# EAGLE design CAN-Bus-Interface (EAGLE 7.7.0)
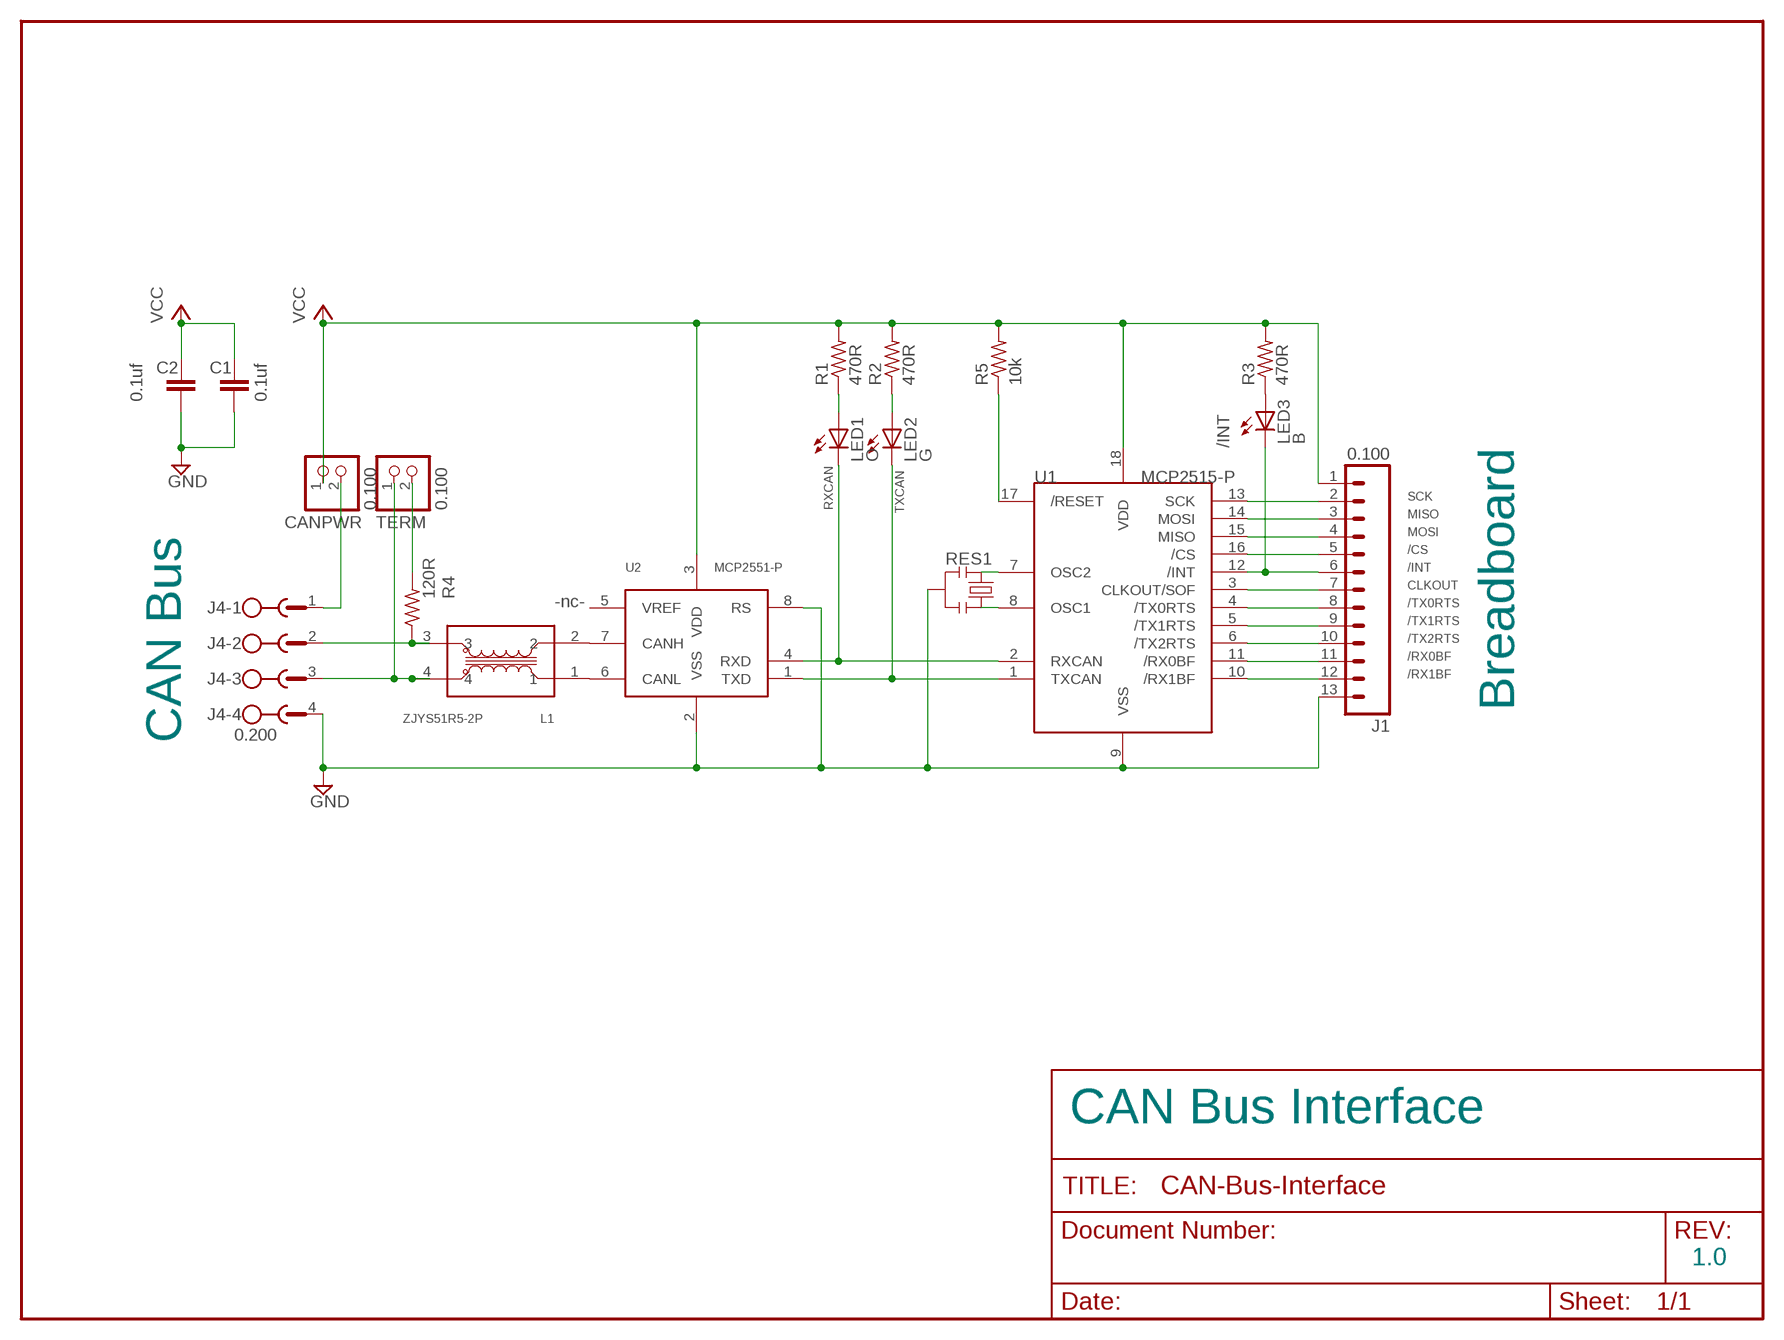
[diagram p0: schematic, sheet 1]

## Parts
C1  0.1uf  CAPPTH2  [CAP-PTH-SMALL2]
C2  0.1uf  CAPPTH2  [CAP-PTH-SMALL2]
CANPWR  0.100  PINHD-1X2  [1X02]
J1  0.100  M13  [1X13]
J4  0.200  MST4V  [MSTBV4]
L1  ZJYS51R5-2P  [ZJYS]
LED1  O  LEDB155  [Q62902-B155]
LED2  G  LEDB155  [Q62902-B155]
LED3  B  LEDB155  [Q62902-B155]
R1  470R  R-US_0204/5  [0204/5]
R2  470R  R-US_0204/5  [0204/5]
R3  470R  R-US_0204/5  [0204/5]
R4  120R  R-US_0204/5  [0204/5]
R5  10k  R-US_0204/5  [0204/5]
RES1  RESONATORPTH  [RESONATOR-PTH]
TERM  0.100  PINHD-1X2  [1X02]
U1  MCP2515-P  [DIL18]
U2  MCP2551-P  [DIL08]

## Nets
/CS: J1.5 U1.16(/CS)
/INT: J1.6 LED3.A(C) U1.12(/INT)
/RESET: R5.1 U1.17(/RESET)
/RX0BF: J1.11 U1.11(/RX0BF)
/RX1BF: J1.12 U1.10(/RX1BF)
/TX0RTS: J1.8 U1.4(/TX0RTS)
/TX1RTS: J1.9 U1.5(/TX1RTS)
/TX2RTS: J1.10 U1.6(/TX2RTS)
CLKOUT: J1.7 U1.3(CLKOUT/SOF)
GND [Power]: C1.2 C2.2 J1.13 J4.4 RES1.2 U1.9(VSS) U2.2(VSS) U2.8(RS)
MISO: J1.3 U1.14(MOSI)
MOSI: J1.4 U1.15(MISO)
N$1: CANPWR.2 J4.1
N$3: L1.1 U2.6(CANL)
N$7: L1.2 U2.7(CANH)
N$8: J4.2 L1.3 R4.1
N$9: J4.3 L1.4 TERM.1
N$10: R4.2 TERM.2
N$11: LED1.K(A) R1.1
N$12: LED2.K(A) R2.1
N$14: LED3.K(A) R3.1
OSC1: RES1.3 U1.8(OSC1)
OSC2: RES1.1 U1.7(OSC2)
RXCAN: LED1.A(C) U1.2(RXCAN) U2.4(RXD)
SCK: J1.2 U1.13(SCK)
TXCAN: LED2.A(C) U1.1(TXCAN) U2.1(TXD)
VCC [Power]: C1.1 C2.1 CANPWR.1 J1.1 R1.2 R2.2 R3.2 R5.2 U1.18(VDD) U2.3(VDD)
Unconnected: U2.5(VREF)

## Notes on the sheet
- Breadboard
- CAN Bus
- -nc-
- CAN Bus Interface
- 1.0

## Library data of the parts
C1 C2 = SparkFun:CAP: Capacitor Standard 0603 ceramic capacitor, and 0.1" leaded capacitor.
CANPWR TERM = pinhead:PINHD-1X2: PIN HEADER
J1 = SparkFun:M13
J4 = con-phoenix-508:MST4V: PHOENIX
L1 = MCP:ZJYS51R5: TDK ZJYS51R5-2P Common Mode Filter
LED1-LED3 = MCP:LED: LED OSRAM: - CHIPLED LG R971, LG N971, LY N971, LG Q971, LY Q971, LO R971, LY R971 LH N974, LH R974 LS Q976, LO Q976, LY Q976 LO Q996 - Hyper CHIPLED LW Q18S LB Q993, LB Q99A, LB R99A - SideLED LS A670, LO A670, LY A670, LG A670, LP A670 LB A673, LV A673, LT A673, LW A673 LH A674 LY A675 LS A676, LA A676, LO A676, LY A676, LW A676 LS A679, LY A679, LG A679 - Hyper Micro SIDELED® LS Y876, LA Y876, LO Y876, LY Y876 LT Y87S - SmartLED LW L88C, LW L88S LB L89C, LB L89S, LG L890 LS L89K, LO L89K, LY L89K LS L896, LA L896, LO L896, LY L896 - TOPLED LS T670, LO T670, LY T670, LG T670, LP T670 LSG T670, LSP T670, LSY T670, LOP T670, LYG T670 LG T671, LOG T671, LSG T671 LB T673, LV T673, LT T673, LW T673 LH T674 LS T676, LA T676, LO T676, LY T676, LB T676, LH T676, LSB T676, LW T676 LB T67C, LV T67C, LT T67C, LS T67K, LO T67K, LY T67K, LW E67C LS E67B, LA E67B, LO E67B, LY E67B, LB E67C, LV E67C, LT E67C LW T67C LS T679, LY T679, LG T679 LS T770, LO T770, LY T770, LG T770, LP T770 LB T773, LV T773, LT T773, LW T773 LH T774 LS E675, LA E675, LY E675, LS T675 LS T776, LA T776, LO T776, LY T776, LB T776 LHGB T686 LT T68C, LB T68C - Hyper Mini TOPLED® LB M676 - Mini TOPLED Santana® LG M470 LS M47K, LO M47K, LY M47K Source: http://www.osram.convergy.de LUXEON: - LUMILED® LXK2-PW12-R00, LXK2-PW12-S00, LXK2-PW14-U00, LXK2-PW14-V00 LXK2-PM12-R00, LXK2-PM12-S00, LXK2-PM14-U00 LXK2-PE12-Q00, LXK2-PE12-R00, LXK2-PE12-S00, LXK2-PE14-T00, LXK2-PE14-U00 LXK2-PB12-K00, LXK2-PB12-L00, LXK2-PB12-M00, LXK2-PB14-N00, LXK2-PB14-P00, LXK2-PB14-Q00 LXK2-PR12-L00, LXK2-PR12-M00, LXK2-PR14-Q00, LXK2-PR14-R00 LXK2-PD12-Q00, LXK2-PD12-R00, LXK2-PD12-S00 LXK2-PH12-R00, LXK2-PH12-S00 LXK2-PL12-P00, LXK2-PL12-Q00, LXK2-PL12-R00 Source: www.luxeon.com KINGBRIGHT: KA-3528ASYC Source: www.kingbright.com
R1-R5 = rcl:R-US_: RESISTOR, American symbol
RES1 = SparkFun:RESONATOR: Resonator Small SMD resonator. This is the itty bitty 10/20MHz resonators with built in caps. CSTCE10M0G55 and CSTCE20M0V53. Footprint has been reviewed closely but hasn't been tested yet.
U1 = MCP:MCP2515: Microchip MCP2515 Stand-Alone CAN Controller With SPI Interface Microchip Technology?s MCP2515 is a stand-alone Controller Area Network (CAN) controller that implements the CAN specification, version 2.0B. It is capable of transmitting and receiving both standard and extended data and remote frames. The MCP2515 has two acceptance masks and six acceptance filters that are used to filter out unwanted messages, thereby reducing the host MCUs overhead. The MCP2515 interfaces with microcontrollers (MCUs) via an industry standard Serial Peripheral Interface (SPI).
U2 = MCP:MCP2551: MCP2551 High-Speed CAN Transceiver

## Net classes
1 Power: width 0.508 mm, clearance 0.254 mm

## Board
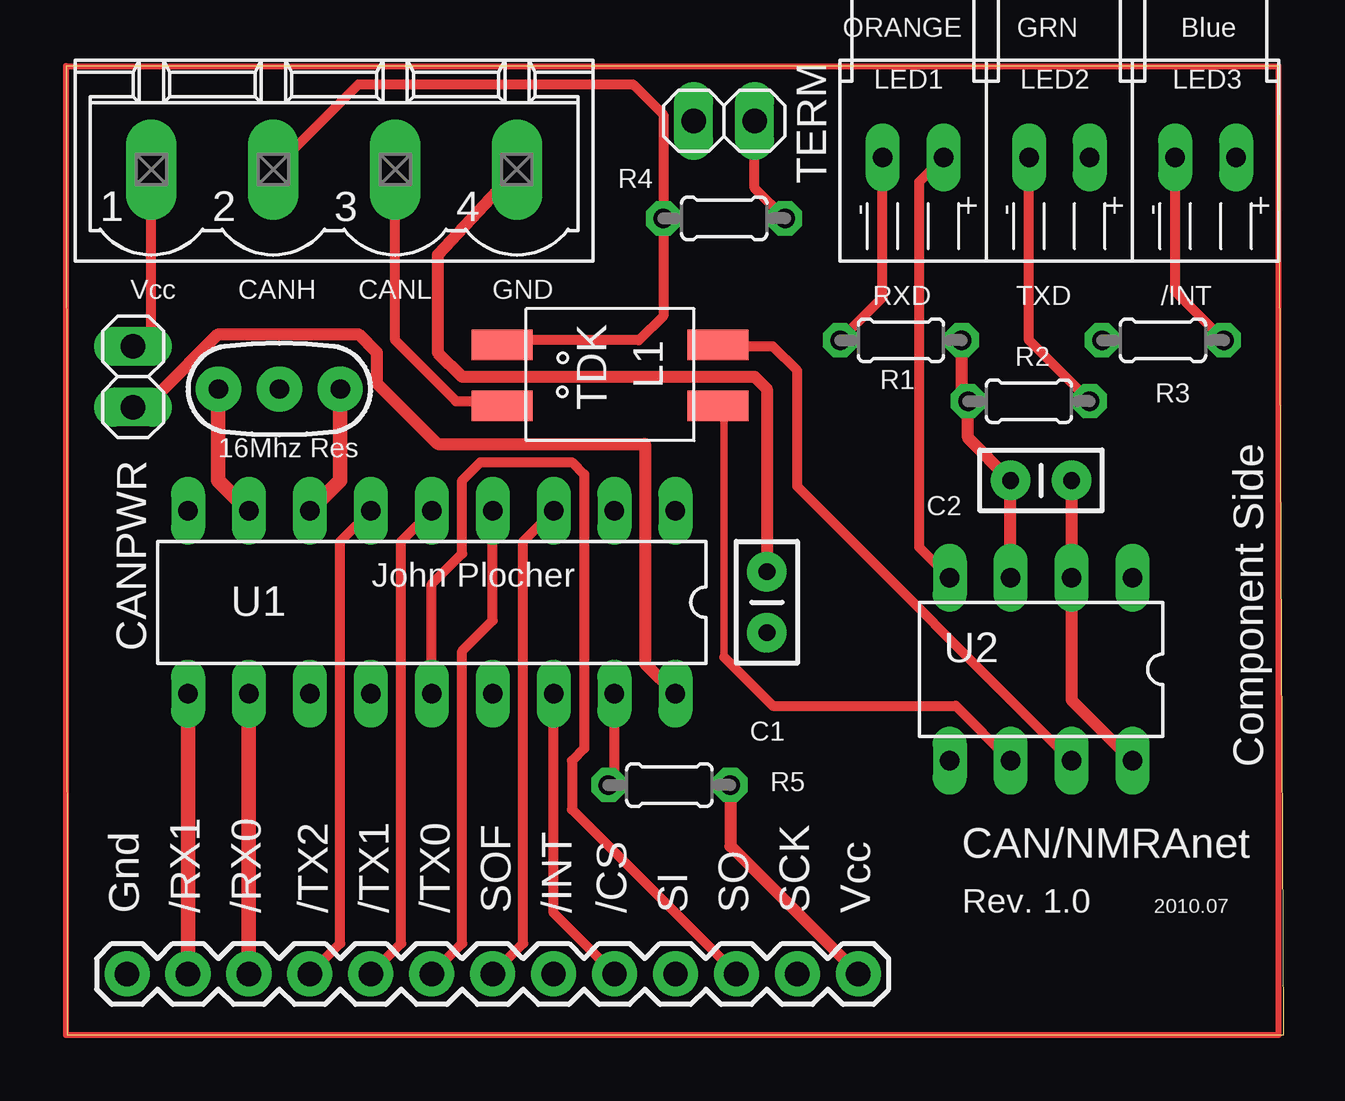
[diagram p1: board, top side]
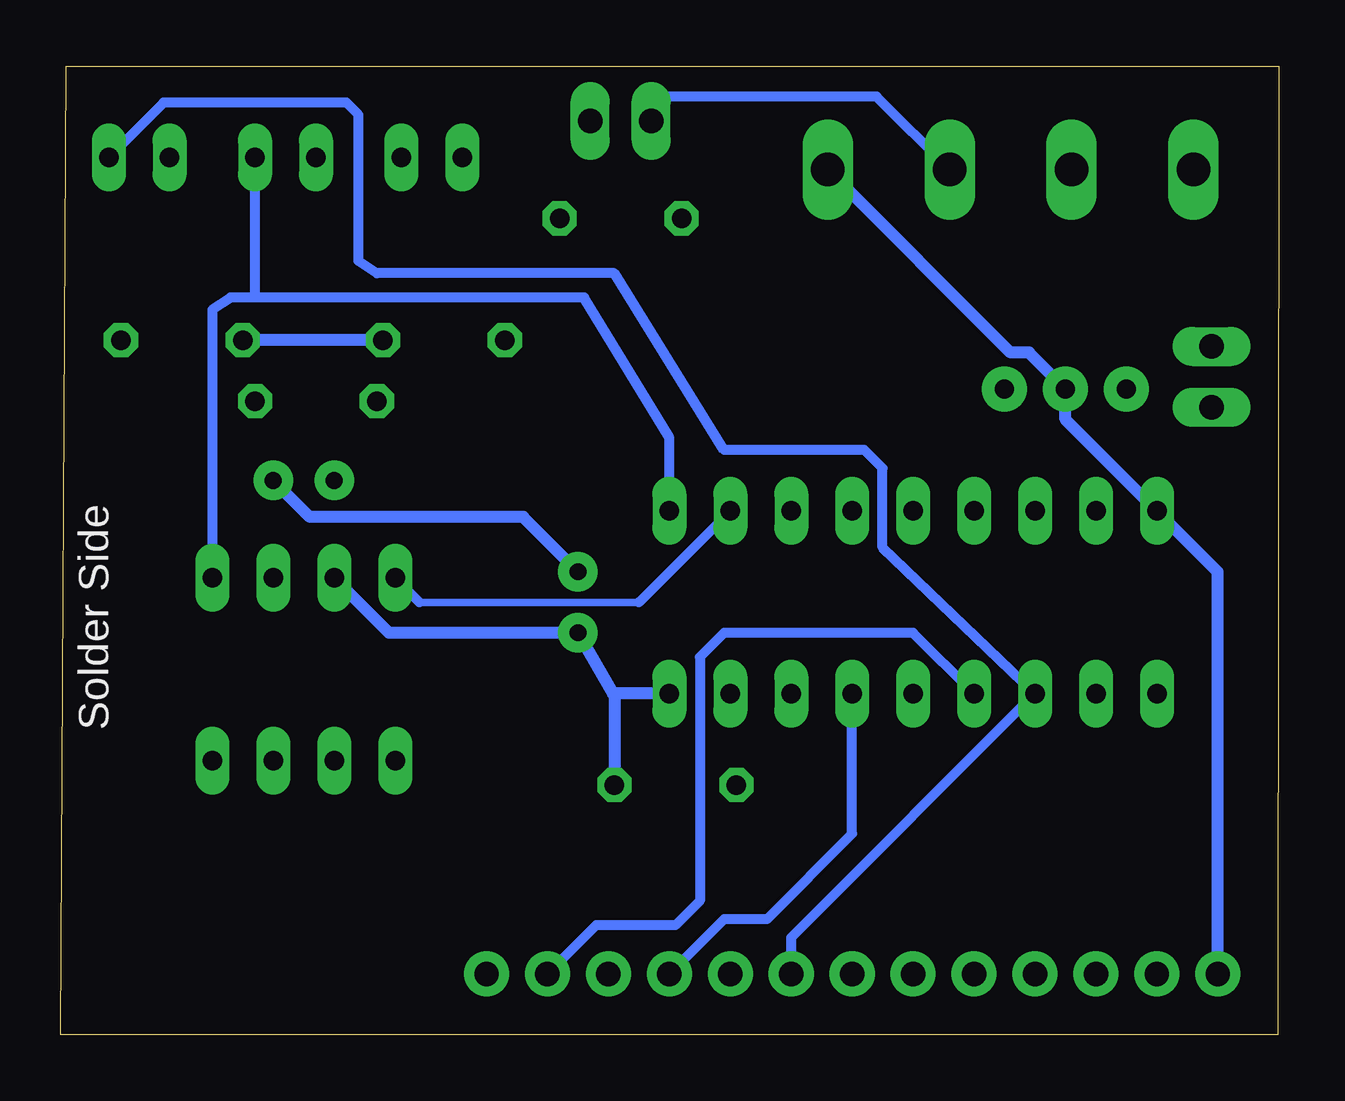
[diagram p2: board, bottom side, seen from below]

Size 50.76 x 40.38 mm. Coordinates in mm from the lower left corner, seen from the top.
Outline: 0.04,0 50.76,0 50.55,40.38 0,40.38 0.04,0
Copper layers (1*16): Top 0.035mm / dielectric 1.5mm / Bottom 0.035mm
Design rules "SparkFun10mil": minimum track width 10mil, minimum drill 20mil, track to track 10mil, track to pad 10mil, pad to pad 10mil, via to via 10mil, smd to smd 10mil, copper to edge 10mil, drill to drill 10mil, minimum pad ring 12mil, minimum via ring 10mil, stop-mask expansion 4mil, vias tented up to drill 25mil, thermal gap 10mil

### Footprints (pad centres in the part's own frame; a part is rotated, then mirrored left to right if it is on the bottom)
CAP-PTH-SMALL2 = drill 0.7 pad 1.651: 1 0,0; 2 2.54,0
1X02 = drill 1.016 long: 1 -1.27,0; 2 1.27,0
1X13 = drill 1.016 pad 1.88: 1 0,0; 2 2.54,0; 3 5.08,0; 4 7.62,0; 5 10.16,0; 6 12.7,0; 7 15.24,0; 8 17.78,0; 9 20.32,0; 10 22.86,0; 11 25.4,0; 12 27.94,0; 13 30.48,0
MSTBV4 = drill 1.397 long: 1 -7.62,0; 2 -2.54,0; 3 2.54,0; 4 7.62,0
ZJYS = smd 2.54 x 1.27: 1 4.32,-1.46; 2 4.32,1.08; 3 -4.68,1.08; 4 -4.68,-1.46
Q62902-B155 = drill 0.813 long: A 7.62,1.27; K 7.62,-1.27
0204/5 = drill 0.813 octagon: 1 -2.54,0; 2 2.54,0
RESONATOR-PTH = drill 0.8 pad 1.88: 1 -2.54,0; 2 0,0; 3 2.54,0
DIL18 = drill 0.813 long: 1 -10.16,-3.81; 2 -7.62,-3.81; 3 -5.08,-3.81; 4 -2.54,-3.81; 5 0,-3.81; 6 2.54,-3.81; 7 5.08,-3.81; 8 7.62,-3.81; 9 10.16,-3.81; 10 10.16,3.81; 11 7.62,3.81; 12 5.08,3.81; 13 2.54,3.81; 14 0,3.81; 15 -2.54,3.81; 16 -5.08,3.81; 17 -7.62,3.81; 18 -10.16,3.81
DIL08 = drill 0.813 long: 1 -3.81,-3.81; 2 -1.27,-3.81; 3 1.27,-3.81; 4 3.81,-3.81; 5 3.81,3.81; 6 1.27,3.81; 7 -1.27,3.81; 8 -3.81,3.81

### Placement (x,y rotation side)
C1  29.21,16.76 90 top
C2  39.37,23.11 0 top
CANPWR  2.79,27.43 90 top
J1  33.02,2.54 180 top
J4  11.18,36.06 0 top
L1  22.86,27.68 0 top
LED1  35.31,44.19 270 top
LED2  41.4,44.19 270 top
LED3  47.5,44.19 270 top
R1  34.8,28.95 0 top
R2  40.13,26.41 180 top
R3  45.72,28.95 180 top
R4  27.43,34.03 0 top
R5  25.15,10.41 0 top
RES1  8.89,26.92 180 top
TERM  27.43,38.09 0 top
U1  15.24,18.03 180 top
U2  40.64,15.23 180 top

### Tracks (layer width: path | path; a pad name or v marks a point on that pad's centre or on a via)
/CS
  Top 0.406: U1.16 20.32,5.08 J1.5
/INT
  Bottom 0.406: J1.6 20.32,4.06 U1.12 16.51,20.32 16.51,23.62 17.27,24.38 23.11,24.38 27.69,31.75 37.59,31.75 38.35,32.25 38.35,38.35 38.86,38.86 46.48,38.86 LED3.A
/RESET
  Top 0.406: R5.1 22.86,10.66 U1.17
/RX0BF
  Top 0.61: J1.11 U1.11
/RX1BF
  Top 0.61: J1.12 U1.10
/TX0RTS
  Top 0.406: U1.4 17.78,17.27 16.51,16 16.51,3.81 J1.8
/TX1RTS
  Top 0.406: U1.5 13.97,20.57 13.97,3.81 J1.9
/TX2RTS
  Top 0.406: U1.6 11.43,20.57 11.43,3.81 J1.10
CLKOUT
  Top 0.406: U1.3 19.05,20.57 19.05,3.81 J1.7
GND
  Top 0.508: C2.2 U2.2 41.91,13.96 U2.8 | C1.2 29.21,26.92 28.7,27.43 16.51,27.43 15.49,28.44 15.49,32.51 J4.4
  Bottom 0.508: C1.2 31.5,21.59 40.39,21.59 C2.2 | J1.13 2.54,19.3 U1.9 8.89,25.65 RES1.2 10.41,28.44 11.18,28.44 J4.4
MISO
  Top 0.406: U1.14 15.24,18.79 16.51,20.06 16.51,23.11 17.27,23.87 21.08,23.87 21.59,23.36 21.59,11.93 21.08,11.42 21.08,9.39 J1.3
MOSI
  Bottom 0.406: U1.15 17.78,8.38 21.34,4.82 23.11,4.82 J1.4
N$1
  Top 0.406: CANPWR.2 3.56,29.46 J4.1
N$3
  Top 0.305: 27.43,15.74 27.43,26.16 L1.1
  Top 0.406: 27.43,15.74 29.46,13.71 37.08,13.71 U2.6
N$4
  Top 0.254: 0,40.38 50.55,40.38 50.55,-0.01 0,-0.01 0,40.38
N$7
  Top 0.305: 27.43,28.7 L1.2
  Top 0.406: 27.43,28.7 29.46,28.7 30.48,27.68 30.48,22.86 U2.7
N$8
  Top 0.305: 18.29,28.95 L1.3
  Top 0.406: 18.29,28.95 23.88,28.95 24.89,29.97 R4.1 24.89,38.35 23.62,39.62 12.19,39.62 J4.2
N$9
  Top 0.305: 18.03,26.41 L1.4
  Top 0.406: 18.03,26.41 16.26,26.41 13.72,28.95 J4.3
  Bottom 0.406: TERM.1 26.16,39.11 16.76,39.11 J4.3
N$10
  Top 0.406: R4.2 28.7,35.3 TERM.2
N$11
  Top 0.406: R1.1 34.04,30.73 LED1.K
N$12
  Top 0.406: R2.1 40.13,28.95 LED2.K
N$14
  Top 0.406: R3.1 46.23,30.98 LED3.K
OSC1
  Top 0.61: U1.8 6.35,23.11 RES1.3
OSC2
  Top 0.61: U1.7 11.43,23.11 RES1.1
RXCAN
  Top 0.406: LED1.A 35.56,35.55 35.56,20.32 U2.4
  Bottom 0.305: 26.67,18.03 35.81,18.03
  Bottom 0.406: U1.2 26.67,18.03 | 35.81,18.03 U2.4
SCK
  Bottom 0.406: U1.13 15.24,16.76 23.11,16.76 24.13,15.74 24.13,5.58 25.15,4.57 28.45,4.57 J1.2
TXCAN
  Bottom 0.406: U1.1 25.4,24.89 28.96,30.73 42.67,30.73 | 42.67,30.73 LED2.A | U2.1 44.45,30.22 43.69,30.73 42.67,30.73
VCC
  Top 0.508: U2.3 C2.1 37.59,24.89 R2.2 37.34,26.67 R1.2 | J1.1 27.69,7.87 R5.2 | CANPWR.1 2.92,26.28 3.87,26.73 6.35,29.21 12.19,29.21 12.95,28.44 12.95,27.17 15.49,24.63 24.13,24.63 24.13,15.49 U1.18
  Bottom 0.508: U2.3 37.08,16.76 C1.1 27.75,14.22 27.69,14.22 | 27.69,14.22 R5.2 | U1.18 27.69,14.22 | R1.2 R3.2

### Text on the board
tPlace: ORANGE | GRN | Blue | Vcc | CANH | CANL | GND | RXD | TXD | /INT | 16Mhz Res | John Plocher | Component Side | CAN/NMRAnet | Gnd | /RX1 | /RX0 | /TX2 | /TX1 | /TX0 | SOF | /INT | /CS | SI | SO | SCK | Vcc | Rev. 1.0 | 2010.07
bNames: Solder Side